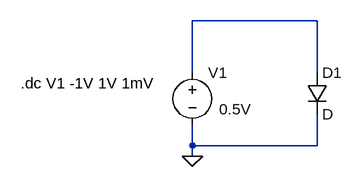
[diagram p0: schematic diode-I-V-curve_V001.asc]
diode-I-V-curve_V001.asc, the LTspice schematic file:
Version 4
SHEET 1 880 680
WIRE 256 64 64 64
WIRE 64 144 64 64
WIRE 256 144 256 64
WIRE 64 256 64 224
WIRE 256 256 256 208
WIRE 256 256 64 256
WIRE 64 272 64 256
FLAG 64 272 0
SYMBOL diode 240 144 R0
SYMATTR InstName D1
SYMBOL voltage 64 128 R0
WINDOW 3 41 72 Left 2
WINDOW 123 0 0 Left 0
WINDOW 39 0 0 Left 0
SYMATTR InstName V1
SYMATTR Value 0.5V
TEXT -200 160 Left 2 !.dc V1 -1V 1V 1mV

The netlist it stands for:
* diode-I-V-curve_V001.asc
D1 N001 0 D
V1 N001 0 0.5V
.model D D
.lib standard.dio
.dc V1 -1V 1V 1mV
.backanno
.end